# Altium schematic sheet 原理图.SchDoc
size A4; SheetNumber: 1; SheetTotal: 1; ENG_APP_DATE: --/--/--; DSN_APP_DATE: --/--/--; CHK_APP_DATE: --/--/--
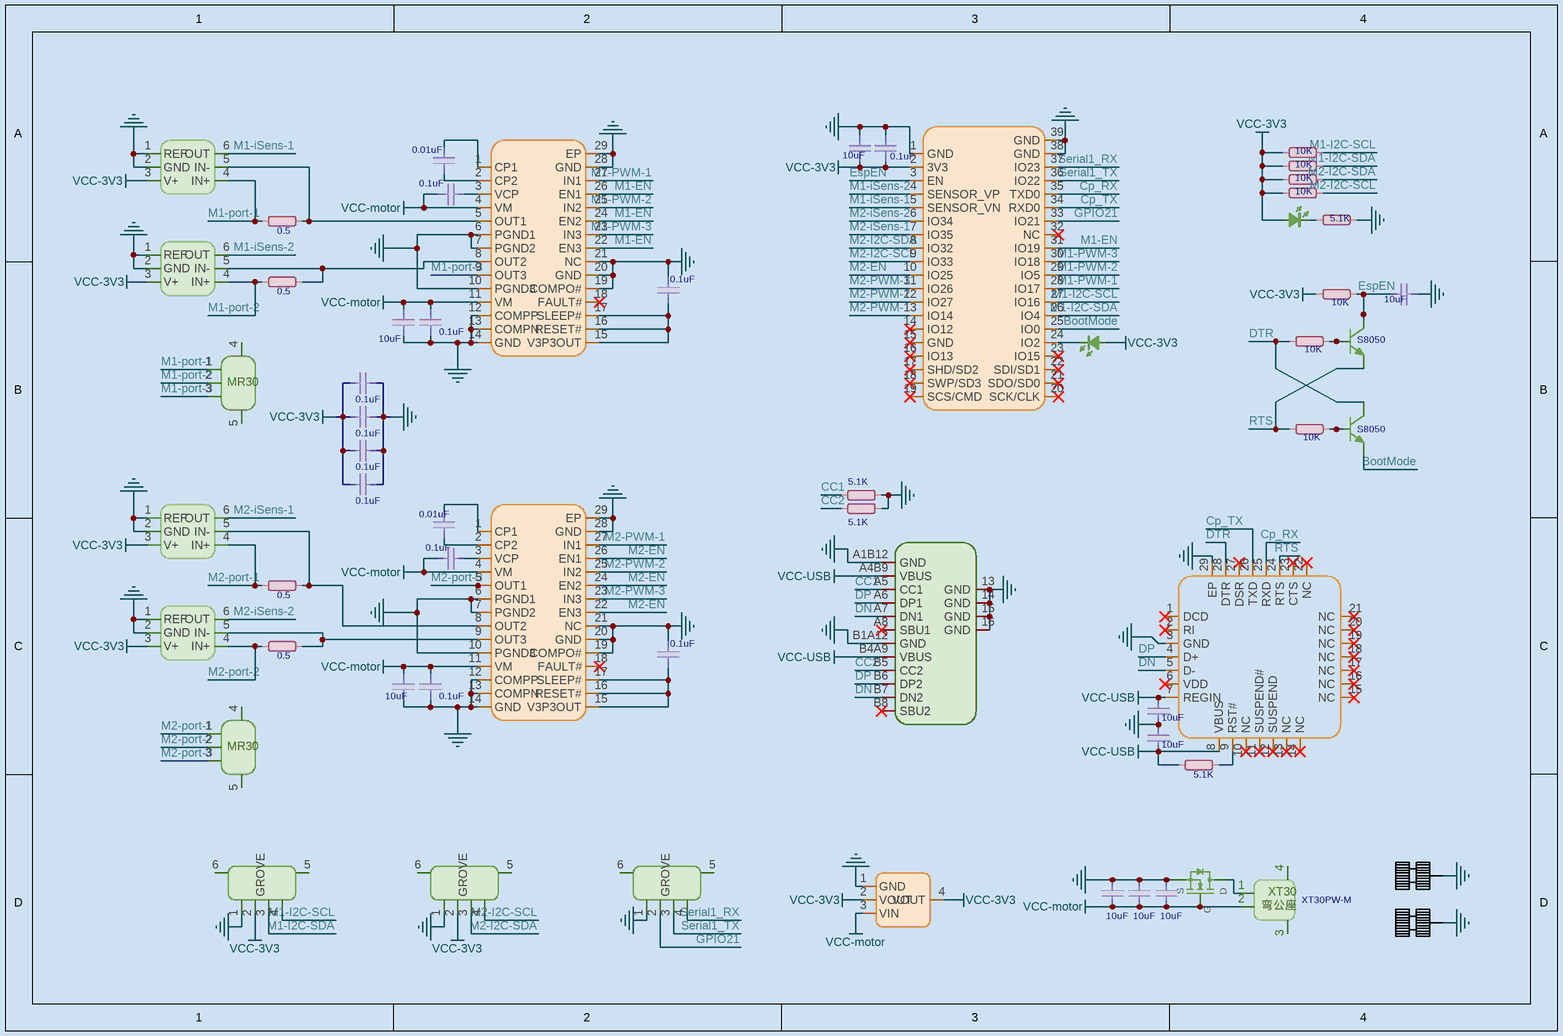
[diagram p0: 原理图.SchDoc]

## Parts
(Parts that share a designator on the sheet are numbered #1, #2 ... from top to bottom, then left to right.)
*1  S8050  [SOT22-3]
*2  S8050  [SOT22-3]
*3  CP2102  [QFN-28]  (value not drawn)
*#1  m2滚花螺母  [m2滚花螺母]  (value not drawn)
*#2  m2滚花螺母  [m2滚花螺母]  (value not drawn)
C1  0.01uF  [电容-0402]
C2  10uF  [电容-0402]
C3  0.1uF  [电容-0402]
C4  0.1uF  [电容-0402]
C5  10uF  [电容-0402]
C6  0.1uF  [电容-0402]
C7  10uF  [电容-0402]
C8  0.1uF  [电容-0402]
C9  0.01uF  [电容-0402]
C10  0.1uF  [电容-0402]
C11  0.1uF  [电容-0402]
C12  10uF  [电容-0402]
C13  0.1uF  [电容-0402]
C14  10uF  [电容-0402]
C15  10uF  [电容-0402]
C16  10uF  [C0603_L]
C17  10uF  [C0603_L]
C18  10uF  [C0603_L]
C?#1  0.1uF  [电容-0402]
C?#2  0.1uF  [电容-0402]
C?#3  0.1uF  [电容-0402]
C?#4  0.1uF  [电容-0402]
CN1  MR30PW-F  [CONN-TH_MR30PW-F]  (value not drawn)
CN2  MR30PW-F  [CONN-TH_MR30PW-F]  (value not drawn)
CN3  XT30PW-M  [CONN-TH_XT30PW-M]
L1  LED-0402  [LED-0402]  (value not drawn)
L2  LED-0402  [LED-0402]  (value not drawn)
Q1  GROVE  [GROVE]  (value not drawn)
Q2  GROVE  [GROVE]  (value not drawn)
Q3  GROVE  [GROVE]  (value not drawn)
Q4  AO3400_C181090  [SOT-23-3_L2.9-W1.3-P1.90-LS2.4-BR]  (value not drawn)
R1  10K  [电阻-0402]
R2  10K  [电阻-0402]
R3  10K  [电阻-0402]
R4  10K  [电阻-0402]
R5  0.5  [R0603_L]
R6  5.1K  [电阻-0402]
R7  10K  [电阻-0402]
R8  0.5  [R0603_L]
R9  10K  [电阻-0402]
R10  10K  [电阻-0402]
R11  5.1K  [电阻-0402]
R12  5.1K  [电阻-0402]
R13  0.5  [R0603_L]
R14  0.5  [R0603_L]
R15  5.1K  [电阻-0402]
U1  INA199B1DCKR  [SC-70-6_L2.2-W1.3-P0.65-LS2.1-BL]  (value not drawn)
U2  ESP32-WROOM-32  [ESP32-WROOM-32]  (value not drawn)
U3  INA199B1DCKR  [SC-70-6_L2.2-W1.3-P0.65-LS2.1-BL]  (value not drawn)
U4  DRV8313PWPR  [HTSSOP-28_L9.8-W4.5-P0.65-LS6.6-BL-EP]  (value not drawn)
U5  INA199B1DCKR  [SC-70-6_L2.2-W1.3-P0.65-LS2.1-BL]  (value not drawn)
U6  INA199B1DCKR  [SC-70-6_L2.2-W1.3-P0.65-LS2.1-BL]  (value not drawn)
U7  DRV8313PWPR  [HTSSOP-28_L9.8-W4.5-P0.65-LS6.6-BL-EP]  (value not drawn)
U8  AMS1117  [SOT-223-3_L6.5-W3.4-P2.30-LS7.0-BR]  (value not drawn)
USBC1  TYPE-C 2.0 -16P  [USB-C-SMD_16P]  (value not drawn)

## Nets
GND: *3.3(GND) *3.29(EP) *#1.0 *#2.0 C2.2 C3.2 C5.2 C6.1 C7.1 C8.1 C11.1 C12.1 C13.1 C14.2 C15.1 C16.1 C17.1 C18.1 C?#1.1 C?#2.1 C?#3.1 C?#4.1 Q1.1 Q2.1 Q3.1 Q4.2(S) R6.2 R11.2 R12.2 U1.1(REF) U1.2(GND) U2.1(GND) U2.38(GND) U2.39(GND) U3.1(REF) U3.2(GND) U4.6(PGND1) U4.7(PGND2) U4.10(PGND3) U4.12(COMPP) U4.13(COMPN) U4.14(GND) U4.19(COMPO#) U4.20(GND) U4.21(NC) U4.28(GND) U4.29(EP) U5.1(REF) U5.2(GND) U6.1(REF) U6.2(GND) U7.6(PGND1) U7.7(PGND2) U7.10(PGND3) U7.12(COMPP) U7.13(COMPN) U7.14(GND) U7.19(COMPO#) U7.20(GND) U7.21(NC) U7.28(GND) U7.29(EP) U8.1(GND) USBC1.13(GND) USBC1.14(GND) USBC1.15(GND) USBC1.16(GND) USBC1.A1B12(GND) USBC1.B1A12(GND)
VCC-3V3: C2.1 C3.1 C?#1.2 C?#2.2 C?#3.2 C?#4.2 L1.1(A) L2.1(A) Q1.2 Q2.2 R1.1 R2.1 R3.1 R4.1 R7.2 U1.3(V+) U2.2(3V3) U3.3(V+) U5.3(V+) U6.3(V+) U8.2(VOUT) U8.4(VOUT)
VCC-motor: C4.2 C7.2 C8.2 C10.2 C12.2 C13.2 C16.2 C17.2 C18.2 CN3.2 Q4.1(G) U4.4(VM) U4.11(VM) U7.4(VM) U7.11(VM) U8.3(VIN)
VCC-USB: *3.7(REGIN) *3.8(VBUS) C14.1 C15.2 R15.1 USBC1.A4B9(VBUS) USBC1.B4A9(VBUS)
BootMode: *2.2(E) U2.25(IO0)
CC1: R11.1 USBC1.A5(CC1)
CC2: R12.1 USBC1.B5(CC2)
Cp_RX: *3.25(RXD) U2.35(TXD0)
Cp_TX: *3.26(TXD) U2.34(RXD0)
DN: *3.5(D-) USBC1.A7(DN1) USBC1.B7(DN2)
DP: *3.4(D+) USBC1.A6(DP1) USBC1.B6(DP2)
DTR: *2.3(C) *3.28(DTR) R9.1
EspEN: *1.3(C) C5.1 R7.1 U2.3(EN)
GPIO21: Q3.2 U2.33(IO21)
M1-EN: U2.31(IO19) U4.22(EN3) U4.24(EN2) U4.26(EN1)
M1-I2C-SCL: Q1.4 R1.2 U2.27(IO16)
M1-I2C-SDA: Q1.3 R2.2 U2.26(IO4)
M1-iSens-1: U1.6(OUT) U2.5(SENSOR_VN)
M1-iSens-2: U2.4(SENSOR_VP) U3.6(OUT)
M1-port-1: CN1.1 R5.1 U1.4(IN+)
M1-port-2: CN1.2 R8.1 U3.4(IN+)
M1-port-3: CN1.3 U4.9(OUT3)
M1-PWM-1: U2.28(IO17) U4.27(IN1)
M1-PWM-2: U2.29(IO5) U4.25(IN2)
M1-PWM-3: U2.30(IO18) U4.23(IN3)
M2-EN: U2.10(IO25) U7.22(EN3) U7.24(EN2) U7.26(EN1)
M2-I2C-SCL: Q2.4 R4.2 U2.9(IO33)
M2-I2C-SDA: Q2.3 R3.2 U2.8(IO32)
M2-iSens-1: U2.7(IO35) U5.6(OUT)
M2-iSens-2: U2.6(IO34) U6.6(OUT)
M2-port-1: CN2.1 R13.1 U5.4(IN+)
M2-port-2: CN2.2 R14.1 U6.4(IN+)
M2-port-3: CN2.3 U7.5(OUT1)
M2-PWM-1: U2.13(IO14) U7.27(IN1)
M2-PWM-2: U2.12(IO27) U7.25(IN2)
M2-PWM-3: U2.11(IO26) U7.23(IN3)
RTS: *1.2(E) *3.24(RTS) R10.1
Serial1_RX: Q3.4 U2.37(IO23)
Serial1_TX: Q3.3 U2.36(IO22)
Net*1_1: *1.1(B) R9.2
Net*2_1: *2.1(B) R10.2
Net*3_9: *3.9(RST#) R15.2
NetC1_1: C1.1 U4.2(CP2)
NetC1_2: C1.2 U4.1(CP1)
NetC4_1: C4.1 U4.3(VCP)
NetC6_2: C6.2 U4.15(V3P3OUT) U4.16(RESET#) U4.17(SLEEP#)
NetC9_1: C9.1 U7.2(CP2)
NetC9_2: C9.2 U7.1(CP1)
NetC10_1: C10.1 U7.3(VCP)
NetC11_2: C11.2 U7.15(V3P3OUT) U7.16(RESET#) U7.17(SLEEP#)
NetCN3_1: CN3.1 Q4.3(D)
NetL1_2: L1.2(K) R6.1
NetL2_2: L2.2(K) U2.24(IO2)
NetR5_2: R5.2 U1.5(IN-) U4.5(OUT1)
NetR8_2: R8.2 U3.5(IN-) U4.8(OUT2)
NetR13_2: R13.2 U5.5(IN-) U7.8(OUT2)
NetR14_2: R14.2 U6.5(IN-) U7.9(OUT3)

Not connected (* = marked no-connect by the designer): *3 1(DCD)* 2(RI)* 6(VDD)* 10(NC)* 11(SUSPEND#)* 12(SUSPEND)* 13(NC)* 14(NC)* 15(NC)* 16(NC)* 17(NC)* 18(NC)* 19(NC)* 20(NC)* 21(NC)* 22(NC)* 23(CTS)* 27(DSR)*; CN1 4 5; CN2 4 5; CN3 3 4; Q1 5 6; Q2 5 6; Q3 5 6; U2 14(IO12)* 15(GND)* 16(IO13)* 17(SHD/SD2)* 18(SWP/SD3)* 19(SCS/CMD)* 20(SCK/CLK)* 21(SDO/SD0)* 22(SDI/SD1)* 23(IO15)* 32(NC)*; U4 18(FAULT#)*; U7 18(FAULT#)*; USBC1 A8(SBU1)* B8(SBU2)*

## Notes on the sheet
- DWG. NO.
- REV.
- SHT.
- THIS DOCUMENT AND THE DATA DISCLOSED HEREIN OR HEREWITH IS THE PROPERTY OF ALTIUM LIMITED AND MAY BE FREELY DISTRIBUTED IN WHOLE. NO RIGHTS ARE RESERVED OR EXPRESS OR IMPLIED WARANTEE GIVEN.
- REVISION
- DESCRIPTION
- DATE
- APPROVED
- ENG:
- APPROVALS
- PROJECT
- DSN:
- CHK:
- REFERENCE DOCUMENTS
- PROJECT REVISION:
- TITLE
- DOCUMENT REVISION:
- DESIGN ITEM:
- BOM:
- FAB DWG:
- PCB DWG:
- ASSY DWG:
- SCALE:
- SIZE
- B
- CAGE CODE
- FILE NAME
- DWG NO.
- SHEET
- OF
- REV
- (in symbol MR30PW-F) MR30
- (in symbol XT30PW-M) XT30; 弯公座

## Library data of the parts
C1-C18 C?#1-C?#4 = 电容: 贴片电容/MLCC电容; BOM名称: 无极性贴片电容
CN1 CN2 = MR30PW-F: Add into BOM: yes; Name: MR30PW-F; Symbol: MR30PW-F; Device: MR30PW-F; LCSC Part Name: MR30PW-F; Supplier Part: C2928110; Manufacturer Part: MR30PW-F; Supplier Footprint: Through hole; JLCPCB Part Class: 扩展库; Supplier: LCSC; Convert to PCB: yes
CN3 = XT30PW-M: Socket,DCsupply,XT30,male,PIN:2; Manufacturer: AMASS(艾迈斯); Add into BOM: yes; Name: XT30PW-M; Symbol: XT30PW-M; Device: XT30PW-M; LCSC Part Name: XT30PW-M公头; Supplier Part: C431092; Manufacturer Part: XT30PW-M; Supplier Footprint: -; JLCPCB Part Class: 扩展库; Datasheet: https://atta.szlcsc.com/upload/public/pdf/source/20220222/6A9F22F7850E25B33E1BE430ADF8560B.pdf; Supplier: LCSC; Convert to PCB: yes
Q4 = AO3400: 类型:N沟道;漏源电压(Vdss):30V;连续漏极电流(Id):5.8A;功率(Pd):350mW;导通电阻(RDS(on)@Vgs,Id):35mΩ@10V,5.8A;阈值电压(Vgs(th)@Id):1.4V@250uA;; Manufacturer: Hottech(合科泰); Add into BOM: yes; Type: N沟道; Drain Source Voltage (Vdss): 30V; Power Dissipation (Pd): 350mW; Name: AO3400; Symbol: AO3400_C181090; Device: AO3400_C181090; LCSC Part Name: N沟道 30V 5.8A; Supplier Part: C181090; Manufacturer Part: AO3400; Supplier Footprint: SOT-23-3; JLCPCB Part Class: 扩展库; Datasheet: https://atta.szlcsc.com/upload/public/pdf/source/20220427/6A3871894567E8883DB64081D5FF8011.pdf; Supplier: LCSC; Convert to PCB: yes; Continuous Drain Current (Id): 5.8A; Drain Source On Resistance (RDS(on)@Vgs,Id): 35mΩ@10V,5.8A; Gate Threshold Voltage (Vgs(th)@Id): 1.4V@250uA
R1-R15 = 电阻: 贴片电阻; BOM名称: 贴片电阻
U1 U3 U5 U6 = INA199B1DCKR: INA199 26V、双向、零漂移、低侧/高侧、电压输出分流监控器; Manufacturer: TI(德州仪器); Add into BOM: yes; Symbol: INA199B1DCKR; Device: INA199B1DCKR; LCSC Part Name: INA199B1DCKR; Supplier Part: C398920; Manufacturer Part: INA199B1DCKR; Supplier Footprint: SC-70-6; JLCPCB Part Class: Extended Part; Datasheet: https://atta.szlcsc.com/upload/public/pdf/source/20190618/C398920_11F1AA1C0E9C9D9BC4E845E2D57884D2.pdf; Supplier: LCSC; Convert to PCB: yes
U4 U7 = DRV8313PWPR: DRV8313 三路 1/2 H 桥驱动器 IC; Manufacturer: TI(德州仪器); Add into BOM: yes; Name: DRV8313PWPR; Symbol: DRV8313PWPR; Device: DRV8313PWPR; LCSC Part Name: DRV8313PWPR; Supplier Part: C92482; Manufacturer Part: DRV8313PWPR; Supplier Footprint: HTSSOP-28; JLCPCB Part Class: 扩展库; Datasheet: https://atta.szlcsc.com/upload/public/pdf/source/20180307/C92482_15204091381071407760.pdf; Supplier: LCSC; Convert to PCB: yes
U8 = AMS1117-3.3_C6186: 输出类型:固定;输出极性:正;输出通道数:1;最大输入电压:-;输出电压:3.3V;压差:1.3V@(800mA);静态电流(地电流):-;输出电流:1A;电源纹波抑制比(PSRR):72dB@(120Hz);噪声:-;特性:-;工作温度:-;; Manufacturer: 美国AMS; Add into BOM: yes; Output Type: 固定; Output Polarity: 正; Number of Outputs: 1; Output Voltage: 3.3V; Output Current: 1A; Name: AMS1117-3.3; Symbol: AMS1117-3.3; Device: AMS1117-3.3_C6186; LCSC Part Name: Vout=3.3V 1A 72dB@(120Hz); Supplier Part: C6186; Manufacturer Part: AMS1117-3.3; Supplier Footprint: SOT-223; JLCPCB Part Class: 基础库; Datasheet: https://atta.szlcsc.com/upload/public/pdf/source/20180727/C6186_7A095716F0823C02F1997A905E26C086.pdf; Supplier: LCSC; Convert to PCB: yes; Maximum Input Voltage: -; Dropout Voltage: 1.3V@(800mA); Quiescent Current (Ground Current): -; Power Supply Rejection Ratio (PSRR): 72dB@(120Hz); Noise: -; Feature: -; Operating Temperature: -
USBC1 = Type-C_16Pin: USB2.0_Type-C_16Pin母座